# Altium schematic sheet waku-ctl.SchDoc (part 1 of 4)
size D; SheetNumber: 1; SheetTotal: 1
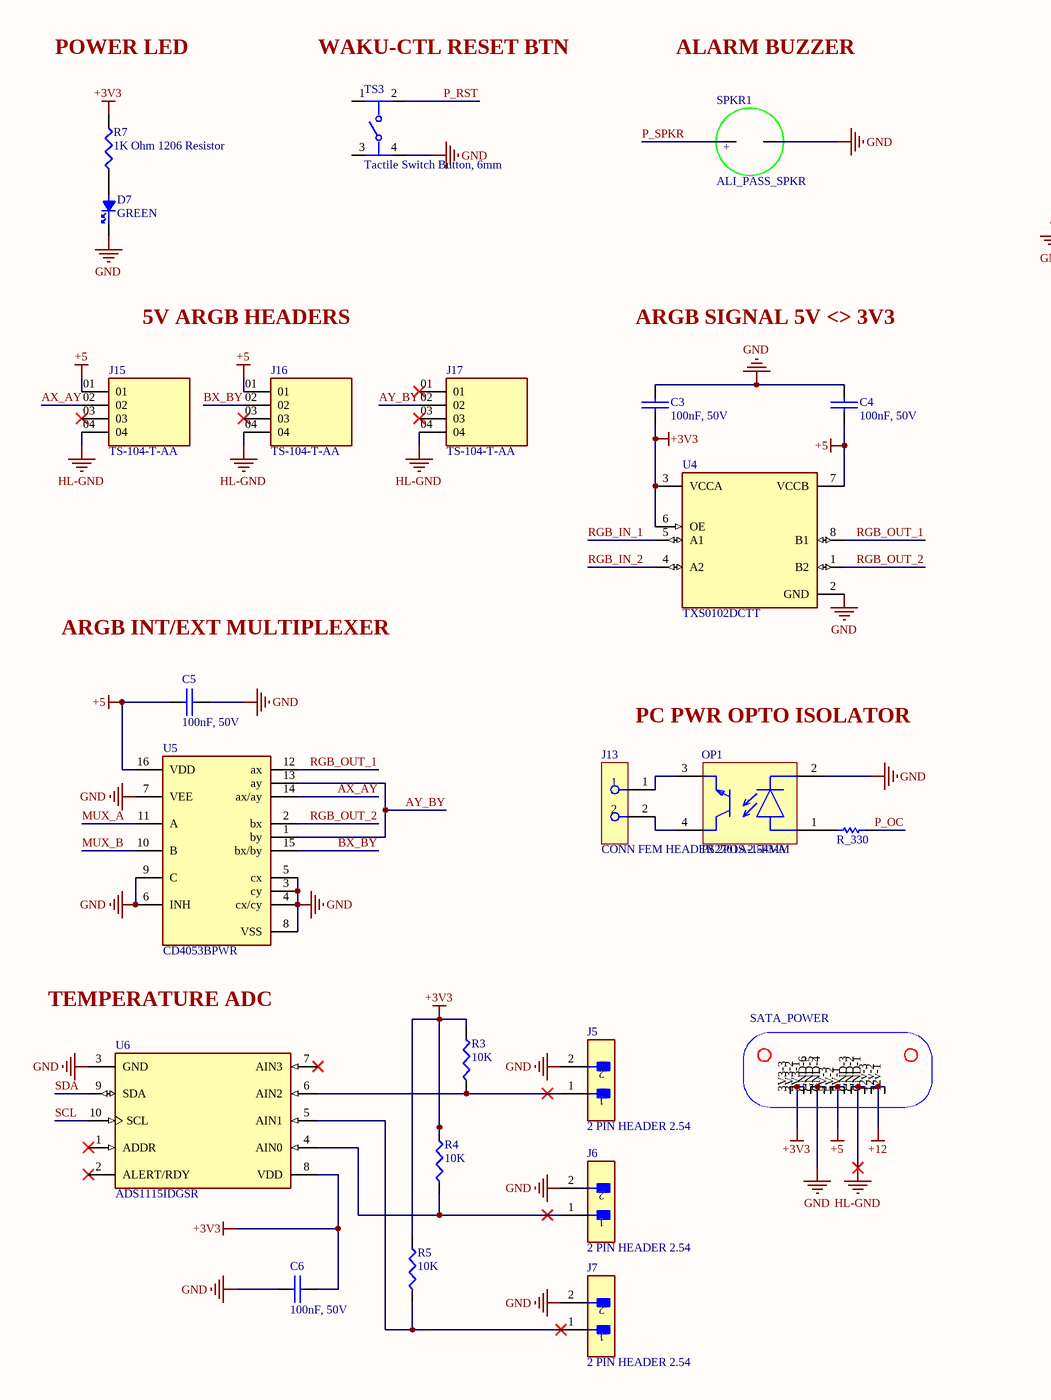
[diagram p0: waku-ctl.SchDoc, top left]
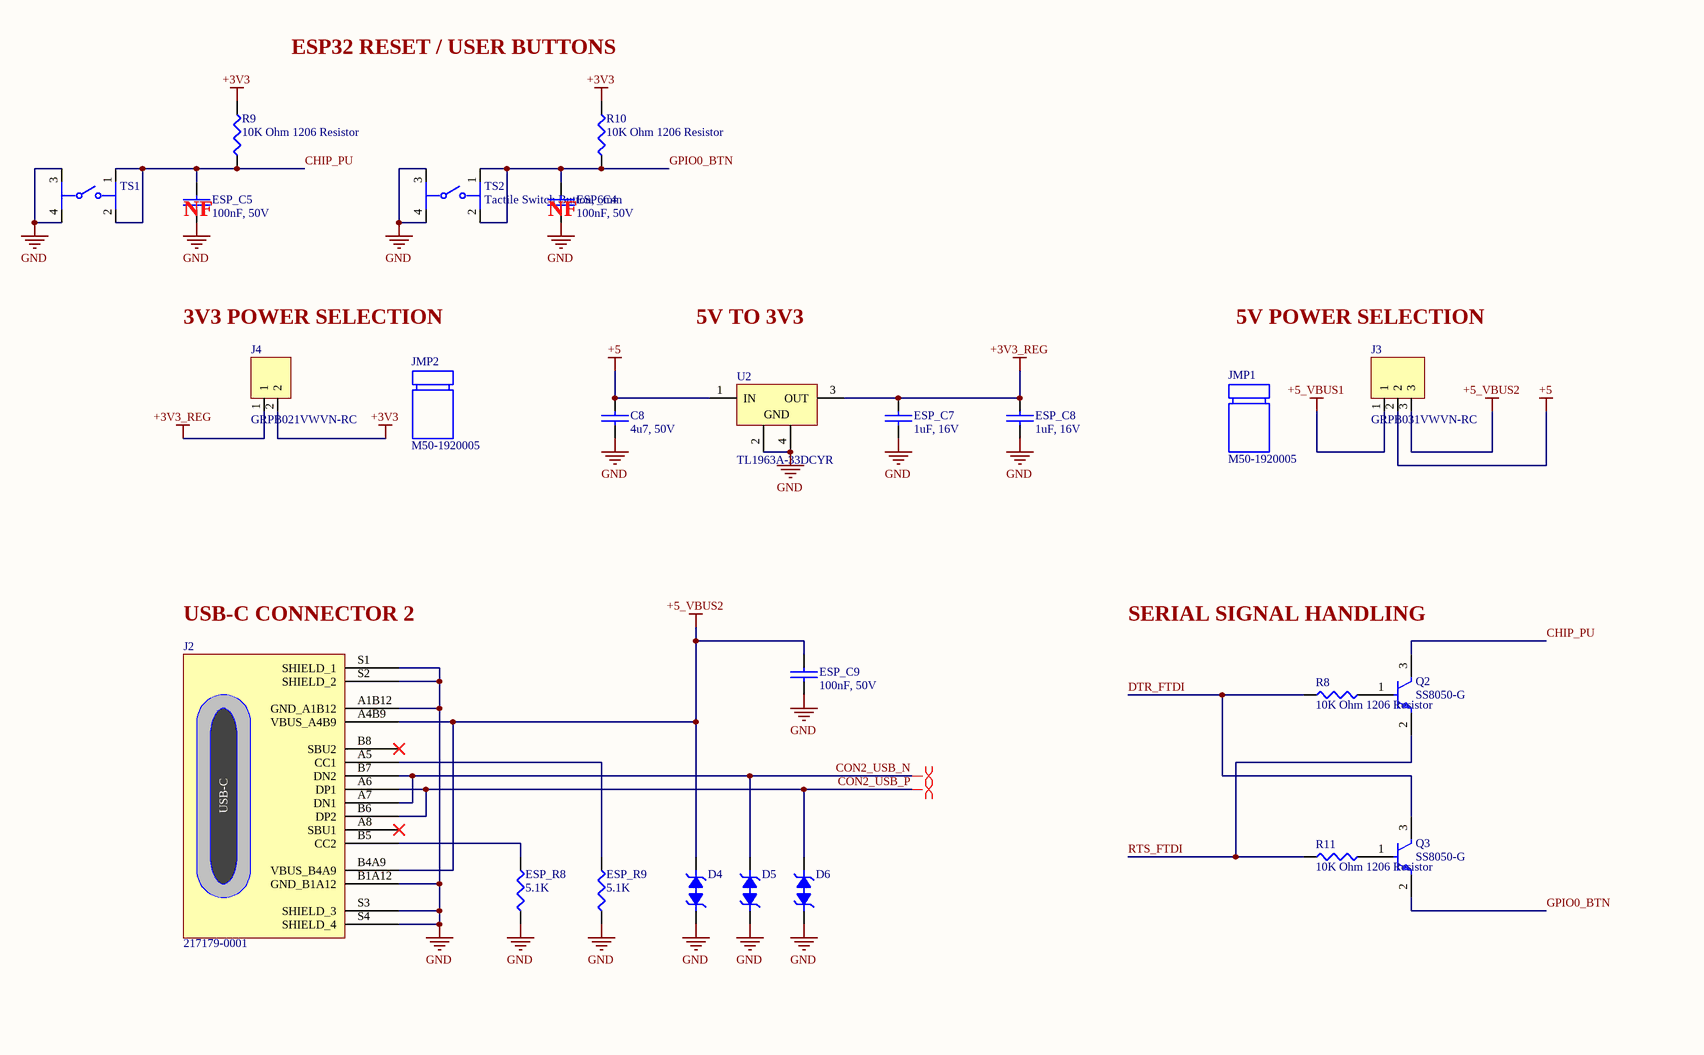
[diagram p1: waku-ctl.SchDoc, top right]
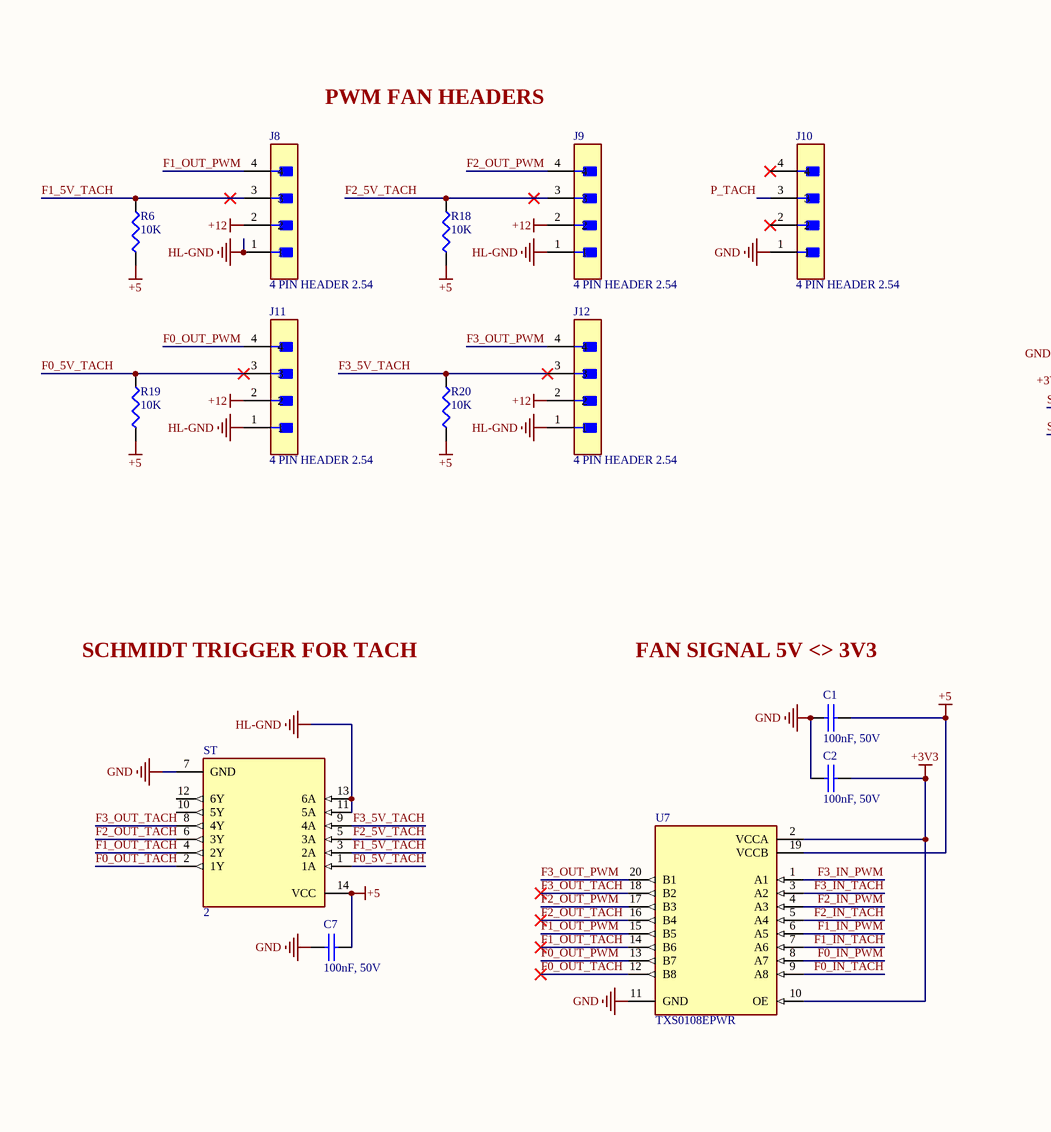
[diagram p2: waku-ctl.SchDoc, bottom left]
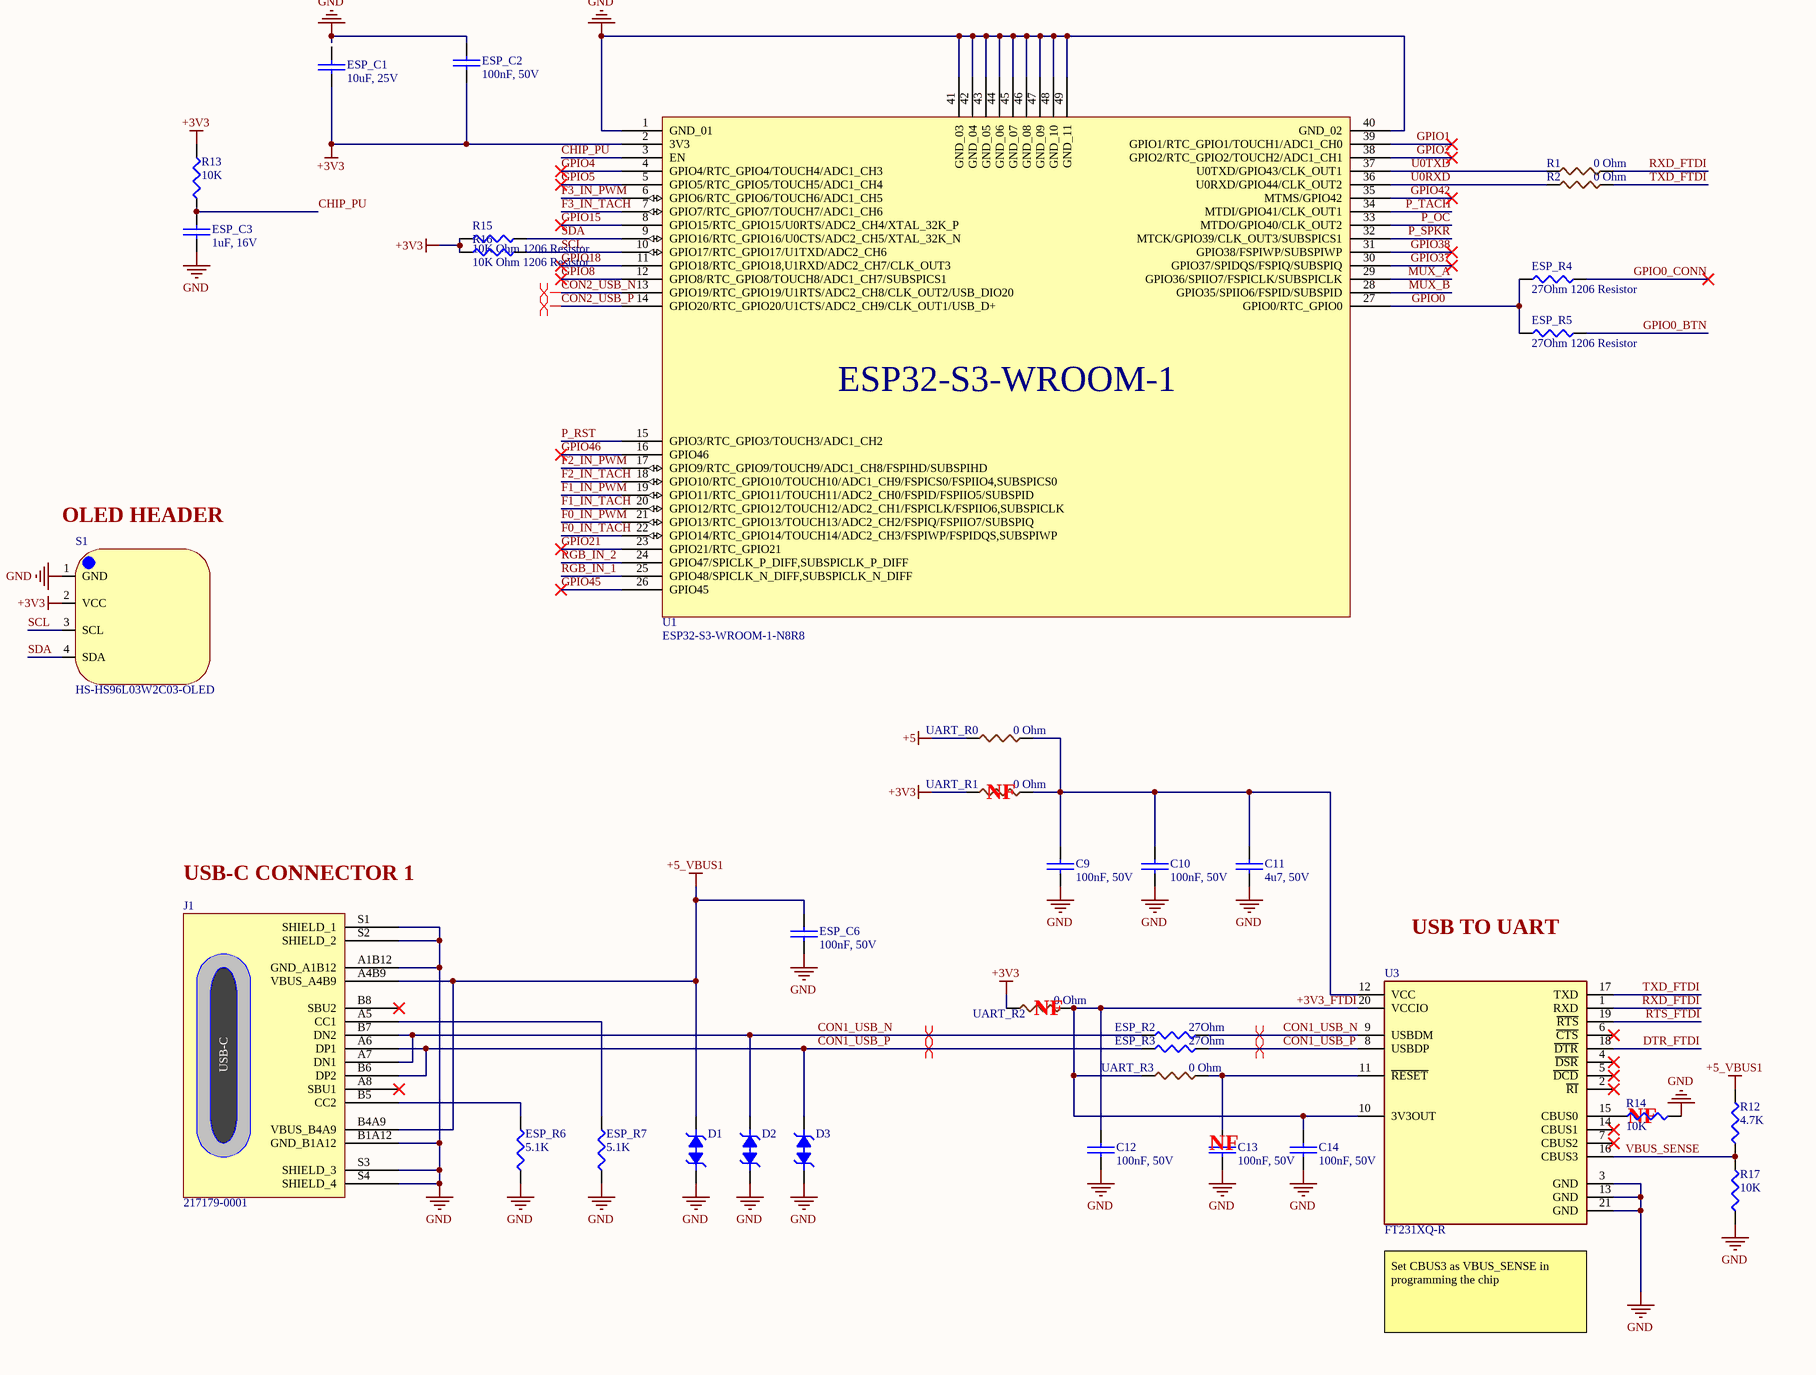
[diagram p3: waku-ctl.SchDoc, bottom right]

## Parts
C1  100nF, 50V  [FP-CL31-IPC_B]
C2  100nF, 50V  [FP-CL31-IPC_B]
C3  100nF, 50V  [FP-CL31-IPC_B]
C4  100nF, 50V  [FP-CL31-IPC_B]
C5  100nF, 50V  [FP-CL31-IPC_B]
C6  100nF, 50V  [FP-CL31-IPC_B]
C7  100nF, 50V  [FP-CL31-IPC_B]
C8  4u7, 50V  [FP-CL31-IPC_B]
C9  100nF, 50V  [FP-CL31-IPC_B]
C10  100nF, 50V  [FP-CL31-IPC_B]
C11  4u7, 50V  [FP-CL31-IPC_B]
C12  100nF, 50V  [FP-CL31-IPC_B]
C13  100nF, 50V  [FP-CL31-IPC_B]
C14  100nF, 50V  [FP-CL31-IPC_B]
D1  ESDL2011PFCT5G  [FP-152AX-MFG]  (value not drawn)
D2  ESDL2011PFCT5G  [FP-152AX-MFG]  (value not drawn)
D3  ESDL2011PFCT5G  [FP-152AX-MFG]  (value not drawn)
D4  ESDL2011PFCT5G  [FP-152AX-MFG]  (value not drawn)
D5  ESDL2011PFCT5G  [FP-152AX-MFG]  (value not drawn)
D6  ESDL2011PFCT5G  [FP-152AX-MFG]  (value not drawn)
D7  GREEN  [FP-VLMO1500-GS08-MFG]
ESP_C1  10uF, 25V  [FP-CL31-IPC_B]
ESP_C2  100nF, 50V  [FP-CL31-IPC_B]
ESP_C3  1uF, 16V  [FP-CL31-IPC_B]
ESP_C4  100nF, 50V  [FP-CL31-IPC_B]
ESP_C5  100nF, 50V  [FP-CL31-IPC_B]
ESP_C6  100nF, 50V  [FP-CL31-IPC_B]
ESP_C7  1uF, 16V  [FP-CL31-IPC_B]
ESP_C8  1uF, 16V  [FP-CL31-IPC_B]
ESP_C9  100nF, 50V  [FP-CL31-IPC_B]
ESP_R2  27Ohm  [FP-RT1206-IPC_B]
ESP_R3  27Ohm  [FP-RT1206-IPC_B]
ESP_R4  27Ohm 1206 Resistor  [FP-RT1206-IPC_B]
ESP_R5  27Ohm 1206 Resistor  [FP-RT1206-IPC_B]
ESP_R6  5.1K  [FP-RT1206-IPC_B]
ESP_R7  5.1K  [FP-RT1206-IPC_B]
ESP_R8  5.1K  [FP-RT1206-IPC_B]
ESP_R9  5.1K  [FP-RT1206-IPC_B]
J1  217179-0001  [FP-2171790001-MFG]
J2  217179-0001  [FP-2171790001-MFG]
J3  GRPB031VWVN-RC  [SLIN-GRPB031VWVN-RC_V]
J4  GRPB021VWVN-RC  [FP-GRPB021VWVN-RC-MFG]
J5  2 PIN HEADER 2.54  [FP-22-28-8020-MFG]
J6  2 PIN HEADER 2.54  [FP-22-28-8020-MFG]
J7  2 PIN HEADER 2.54  [FP-22-28-8020-MFG]
J8  4 PIN HEADER 2.54  [FP-470531000-MFG]
J9  4 PIN HEADER 2.54  [FP-470531000-MFG]
J10  4 PIN HEADER 2.54  [FP-470531000-MFG]
J11  4 PIN HEADER 2.54  [FP-470531000-MFG]
J12  4 PIN HEADER 2.54  [FP-470531000-MFG]
J13  CONN FEM HEADER 2POS 2.54MM  [SSQ-102-02-T-S-RA_MFG]
J15  TS-104-T-AA  [SAMTEC_TS-104-T-AA]
J16  TS-104-T-AA  [SAMTEC_TS-104-T-AA]
J17  TS-104-T-AA  [SAMTEC_TS-104-T-AA]
JMP1  M50-1920005  (mechanical)
JMP2  M50-1920005  (mechanical)
OP1  PS2701A-1-F3-A  [SOP-OPTO3_MFG]
Q2  SS8050-G  [FP-SS8050-G-IPC_B]
Q3  SS8050-G  [FP-SS8050-G-IPC_B]
R1  0 Ohm  [FP-RT1206-IPC_B]
R2  0 Ohm  [FP-RT1206-IPC_B]
R3  10K  [FP-RT1206-IPC_B]
R4  10K  [FP-RT1206-IPC_B]
R5  10K  [FP-RT1206-IPC_B]
R6  10K  [FP-RT1206-IPC_B]
R7  1K Ohm 1206 Resistor  [FP-RT1206-IPC_B]
R8  10K Ohm 1206 Resistor  [FP-RT1206-IPC_B]
R9  10K Ohm 1206 Resistor  [FP-RT1206-IPC_B]
R10  10K Ohm 1206 Resistor  [FP-RT1206-IPC_B]
R11  10K Ohm 1206 Resistor  [FP-RT1206-IPC_B]
R12  4.7K  [FP-RT1206-IPC_B]
R13  10K  [FP-RT1206-IPC_B]
R14  10K  [FP-RT1206-IPC_B]
R15  10K Ohm 1206 Resistor  [FP-RT1206-IPC_B]
R16  10K Ohm 1206 Resistor  [FP-RT1206-IPC_B]
R17  10K  [FP-RT1206-IPC_B]
R18  10K  [FP-RT1206-IPC_B]
R19  10K  [FP-RT1206-IPC_B]
R20  10K  [FP-RT1206-IPC_B]
R_330  RC1206JR-13330RL  [RESC3116X65X40NL10T20]  (value not drawn)
S1  HS-HS96L03W2C03-OLED  [HS-HS96L03W2C03-OLED]
SATA_POWER  (no value)  [Sata_15pin_power]
SPKR1  ALI_PASS_SPKR  [HC9042-16]
ST  2  [FP-SOT108-1-MFG]
TS1  Tactile Switch Button, 6mm  [FP-PTS645SH50SMTR92LFS-MFG]  (value not drawn)
TS2  Tactile Switch Button, 6mm  [FP-PTS645SH50SMTR92LFS-MFG]
TS3  Tactile Switch Button, 6mm  [FP-PTS645SH50SMTR92LFS-MFG]
U1  ESP32-S3-WROOM-1-N8R8  [XCVR_ESP32S3WROOM1N8R8]
U2  TL1963A-33DCYR  [DCY0004A_N]
U3  FT231XQ-R  [FP-QFN-20-IPC_B]
U4  TXS0102DCTT  [FP-DCT0008A-MFG]
U5  CD4053BPWR  [FP-PW0016A-IPC_B]
U6  ADS1115IDGSR  [FP-DGS0010A-MFG]
U7  TXS0108EPWR  [FP-PW0020A-IPC_B]
UART_R0  0 Ohm  [FP-RT1206-IPC_B]
UART_R1  0 Ohm  [FP-RT1206-IPC_B]
UART_R2  0 Ohm  [FP-RT1206-IPC_B]
UART_R3  0 Ohm  [FP-RT1206-IPC_B]

## Nets
+3V3: C2.2 C3.1 C6.2 ESP_C1.1 ESP_C2.2 J4.2 R3.2 R4.2 R5.2 R7.2 R9.2 R10.2 R13.2 R15.1 R16.1 S1.2(VCC) SATA_POWER.3V3-1 SATA_POWER.3V3-2 SATA_POWER.3V3-3 U1.2(3V3) U4.3(VCCA) U4.6(OE) U6.8(VDD) U7.2(VCCA) U7.10(OE) UART_R1.1 UART_R2.1
+3V3_REG: ESP_C7.1 ESP_C8.1 J4.1 U2.3(OUT)
+5: C1.2 C4.1 C5.1 C7.2 C8.1 J3.2 J15.01 J16.01 R6.1 R18.1 R19.1 R20.1 SATA_POWER.5V-1 SATA_POWER.5V-2 SATA_POWER.5V-3 ST.14(VCC) U2.1(IN) U4.7(VCCB) U5.16(VDD) U7.19(VCCB) UART_R0.1
+5_VBUS1: D1.2 ESP_C6.1 J1.A4B9(VBUS_A4B9) J1.B4A9(VBUS_B4A9) J3.1 R12.2
+5_VBUS2: D4.2 ESP_C9.1 J2.A4B9(VBUS_A4B9) J2.B4A9(VBUS_B4A9) J3.3
+12: J8.2 J9.2 J11.2 J12.2 SATA_POWER.12v-1 SATA_POWER.12v-2 SATA_POWER.12v-3
GND: C1.1 C2.1 C3.2 C4.2 C5.2 C6.1 C7.1 C8.2 C9.1 C10.1 C11.1 C12.1 C13.1 C14.1 D1.1 D2.1 D3.1 D4.1 D5.1 D6.1 D7.1 ESP_C2.1 ESP_C3.1 ESP_C4.1 ESP_C5.1 ESP_C6.2 ESP_C7.2 ESP_C8.2 ESP_C9.2 ESP_R6.1 ESP_R7.1 ESP_R8.1 ESP_R9.1 J1.A1B12(GND_A1B12) J1.B1A12(GND_B1A12) J1.S1(SHIELD_1) J1.S2(SHIELD_2) J1.S3(SHIELD_3) J1.S4(SHIELD_4) J2.A1B12(GND_A1B12) J2.B1A12(GND_B1A12) J2.S1(SHIELD_1) J2.S2(SHIELD_2) J2.S3(SHIELD_3) J2.S4(SHIELD_4) J5.2 J6.2 J7.2 J10.1 OP1.2(CATHODE) R14.2 R17.1 S1.1(GND) SATA_POWER.GND-4 SATA_POWER.GND-5 SATA_POWER.GND-6 SPKR1.2 ST.7(GND) TS1.3 TS1.4 TS2.3 TS2.4 TS3.4 U1.1(GND_01) U1.40(GND_02) U1.41(GND_03) U1.42(GND_04) U1.43(GND_05) U1.44(GND_06) U1.45(GND_07) U1.46(GND_08) U1.47(GND_09) U1.48(GND_10) U1.49(GND_11) U2.2(GND) U2.4(GND) U3.3(GND) U3.13(GND) U3.21(GND) U4.2(GND) U5.3(cy) U5.4(cx/cy) U5.5(cx) U5.6(INH) U5.7(VEE) U5.8(VSS) U5.9(C) U6.3(GND) U7.11(GND)
HL-GND: J8.1 J9.1 J11.1 J12.1 J15.04 J16.04 J17.04 SATA_POWER.GND-1 SATA_POWER.GND-2 SATA_POWER.GND-3 ST.11(5A) ST.13(6A)
+3V3_FTDI: C12.2 C14.2 U3.10(3V3OUT) U3.20(VCCIO) UART_R2.2 UART_R3.1
AX_AY: J15.02 U5.14(ax/ay)
AY_BY: J17.02 U5.1(by) U5.13(ay)
BX_BY: J16.02 U5.15(bx/by)
CHIP_PU: ESP_C3.2 ESP_C5.2 Q2.3(C) R9.1 R13.1 TS1.1 TS1.2 U1.3(EN)
CON1_USB_N: D2.2 ESP_R2.1 ESP_R2.2 J1.A7(DN1) J1.B7(DN2) U3.9(USBDM)
CON1_USB_P: D3.2 ESP_R3.1 ESP_R3.2 J1.A6(DP1) J1.B6(DP2) U3.8(USBDP)
CON2_USB_N: D5.2 J2.A7(DN1) J2.B7(DN2) U1.13(GPIO19/RTC_GPIO19/U1RTS/ADC2_CH8/CLK_OUT2/USB_DIO20)
CON2_USB_P: D6.2 J2.A6(DP1) J2.B6(DP2) U1.14(GPIO20/RTC_GPIO20/U1CTS/ADC2_CH9/CLK_OUT1/USB_D+)
DTR_FTDI: Q3.3(C) R8.1 U3.18(~{DTR})
F0_5V_TACH: J11.3 R19.2 ST.1(1A)
F0_IN_PWM: U1.21(GPIO13/RTC_GPIO13/TOUCH13/ADC2_CH2/FSPIQ/FSPIIO7/SUBSPIQ) U7.8(A7)
F0_IN_TACH: U1.22(GPIO14/RTC_GPIO14/TOUCH14/ADC2_CH3/FSPIWP/FSPIDQS,SUBSPIWP) U7.9(A8)
F0_OUT_PWM: J11.4 U7.13(B7)
F0_OUT_TACH: ST.2(1Y) U7.12(B8)
F1_5V_TACH: J8.3 R6.2 ST.3(2A)
F1_IN_PWM: U1.19(GPIO11/RTC_GPIO11/TOUCH11/ADC2_CH0/FSPID/FSPIIO5/SUBSPID) U7.6(A5)
F1_IN_TACH: U1.20(GPIO12/RTC_GPIO12/TOUCH12/ADC2_CH1/FSPICLK/FSPIIO6,SUBSPICLK) U7.7(A6)
F1_OUT_PWM: J8.4 U7.15(B5)
F1_OUT_TACH: ST.4(2Y) U7.14(B6)
F2_5V_TACH: J9.3 R18.2 ST.5(3A)
F2_IN_PWM: U1.17(GPIO9/RTC_GPIO9/TOUCH9/ADC1_CH8/FSPIHD/SUBSPIHD) U7.4(A3)
F2_IN_TACH: U1.18(GPIO10/RTC_GPIO10/TOUCH10/ADC1_CH9/FSPICS0/FSPIIO4,SUBSPICS0) U7.5(A4)
F2_OUT_PWM: J9.4 U7.17(B3)
F2_OUT_TACH: ST.6(3Y) U7.16(B4)
F3_5V_TACH: J12.3 R20.2 ST.9(4A)
F3_IN_PWM: U1.6(GPIO6/RTC_GPIO6/TOUCH6/ADC1_CH5) U7.1(A1)
F3_IN_TACH: U1.7(GPIO7/RTC_GPIO7/TOUCH7/ADC1_CH6) U7.3(A2)
F3_OUT_PWM: J12.4 U7.20(B1)
F3_OUT_TACH: ST.8(4Y) U7.18(B2)
GPIO0: ESP_R4.1 ESP_R5.1 U1.27(GPIO0/RTC_GPIO0)
GPIO0_BTN: ESP_C4.2 ESP_R5.2 Q3.2(E) R10.1 TS2.1 TS2.2
GPIO0_CONN: ESP_R4.2
GPIO1: U1.39(GPIO1/RTC_GPIO1/TOUCH1/ADC1_CH0)
GPIO2: U1.38(GPIO2/RTC_GPIO2/TOUCH2/ADC1_CH1)
GPIO4: U1.4(GPIO4/RTC_GPIO4/TOUCH4/ADC1_CH3)
GPIO5: U1.5(GPIO5/RTC_GPIO5/TOUCH5/ADC1_CH4)
GPIO8: U1.12(GPIO8/RTC_GPIO8/TOUCH8/ADC1_CH7/SUBSPICS1)
GPIO15: U1.8(GPIO15/RTC_GPIO15/U0RTS/ADC2_CH4/XTAL_32K_P)
GPIO18: U1.11(GPIO18/RTC_GPIO18,U1RXD/ADC2_CH7/CLK_OUT3)
GPIO21: U1.23(GPIO21/RTC_GPIO21)
GPIO37: U1.30(GPIO37/SPIDQS/FSPIQ/SUBSPIQ)
GPIO38: U1.31(GPIO38/FSPIWP/SUBSPIWP)
GPIO42: U1.35(MTMS/GPIO42)
GPIO45: U1.26(GPIO45)
GPIO46: U1.16(GPIO46)
MUX_A: U1.29(GPIO36/SPIIO7/FSPICLK/SUBSPICLK) U5.11(A)
MUX_B: U1.28(GPIO35/SPIIO6/FSPID/SUBSPID) U5.10(B)
P_OC: R_330.2 U1.33(MTDO/GPIO40/CLK_OUT2)
P_RST: TS3.2 U1.15(GPIO3/RTC_GPIO3/TOUCH3/ADC1_CH2)
P_SPKR: SPKR1.1 U1.32(MTCK/GPIO39/CLK_OUT3/SUBSPICS1)
P_TACH: J10.3 U1.34(MTDI/GPIO41/CLK_OUT1)
RGB_IN_1: U1.25(GPIO48/SPICLK_N_DIFF,SUBSPICLK_N_DIFF) U4.5(A1)
RGB_IN_2: U1.24(GPIO47/SPICLK_P_DIFF,SUBSPICLK_P_DIFF) U4.4(A2)
RGB_OUT_1: U4.8(B1) U5.12(ax)
RGB_OUT_2: U4.1(B2) U5.2(bx)
RTS_FTDI: Q2.2(E) R11.1 U3.19(~{RTS})
RXD_FTDI: R1.2 U3.1(RXD)
SCL: R16.2 S1.3(SCL) U1.10(GPIO17/RTC_GPIO17/U1TXD/ADC2_CH6) U6.10(SCL)
SDA: R15.2 S1.4(SDA) U1.9(GPIO16/RTC_GPIO16/U0CTS/ADC2_CH5/XTAL_32K_N) U6.9(SDA)
TXD_FTDI: R2.2 U3.17(TXD)
U0RXD: R2.1 U1.36(U0RXD/GPIO44/CLK_OUT2)
U0TXD: R1.1 U1.37(U0TXD/GPIO43/CLK_OUT1)
VBUS_SENSE: R12.1 R17.2 U3.16(CBUS3)
NetC9_2: C9.2 C10.2 C11.2 U3.12(VCC) UART_R0.2 UART_R1.2
NetC13_2: C13.2 U3.11(~{RESET}) UART_R3.2
NetD7_2: D7.2 R7.1
NetESP_R6_2: ESP_R6.2 J1.B5(CC2)
NetESP_R7_2: ESP_R7.2 J1.A5(CC1)
NetESP_R8_2: ESP_R8.2 J2.B5(CC2)
NetESP_R9_2: ESP_R9.2 J2.A5(CC1)
NetJ5_1: J5.1 R3.1 U6.6(AIN2)
NetJ6_1: J6.1 R4.1 U6.4(AIN0)
NetJ7_1: J7.1 R5.1 U6.5(AIN1)
NetJ13_1: J13.1 OP1.3(EMITTER)
NetJ13_2: J13.2 OP1.4(COLLECTOR)
NetOP1_1: OP1.1(ANODE) R_330.1
NetQ2_1: Q2.1(B) R8.2
NetQ3_1: Q3.1(B) R11.2
NetR14_1: R14.1 U3.15(CBUS0)

Not connected (* = marked no-connect by the designer): ESP_C1 2; J1 A8(SBU1)* B8(SBU2)*; J2 A8(SBU1)* B8(SBU2)*; J10 2* 4*; J15 03*; J16 03*; J17 01* 03*; ST 10(5Y) 12(6Y); TS3 1 3; U3 2(~{RI})* 4(~{DSR})* 5(~{DCD})* 6(~{CTS})* 7(CBUS2)* 14(CBUS1)*; U6 1(ADDR)* 2(ALERT/RDY)* 7(AIN3)*

## Layout directives
differential pair; differential pair class DIFF90: CON1_USB_N, CON1_USB_P, CON2_USB_N, CON2_USB_P

## Notes on the sheet
- POWER LED
- (near TS3) WAKU-CTL RESET BTN
- ALARM BUZZER
- ESP32 RESET / USER BUTTONS
- (near ESP_C5) NF
- (near ESP_C4) NF
- 5V ARGB HEADERS
- ARGB SIGNAL 5V <> 3V3
- 3V3 POWER SELECTION
- 5V TO 3V3
- 5V POWER SELECTION
- (near J2) USB-C CONNECTOR 2
- SERIAL SIGNAL HANDLING
- ARGB INT/EXT MULTIPLEXER
- PC PWR OPTO ISOLATOR
- TEMPERATURE ADC
- PWM FAN HEADERS
- (near S1) OLED HEADER
- (near UART_R1) NF
- SCHMIDT TRIGGER FOR TACH
- FAN SIGNAL 5V <> 3V3
- (near J1) USB-C CONNECTOR 1
- USB TO UART
- (near UART_R2) NF
- (near C13) NF
- (near R14) NF
- (near U3) Set CBUS3 as VBUS_SENSE in programming the chip
- (in symbol 217179-0001) USB-C
- (in symbol ESP32-S3-WROOM-1-N8R8) ESP32-S3-WROOM-1
- (in symbol HC9042-16) +